# Altium schematic sheet MCU.SchDoc
size A3
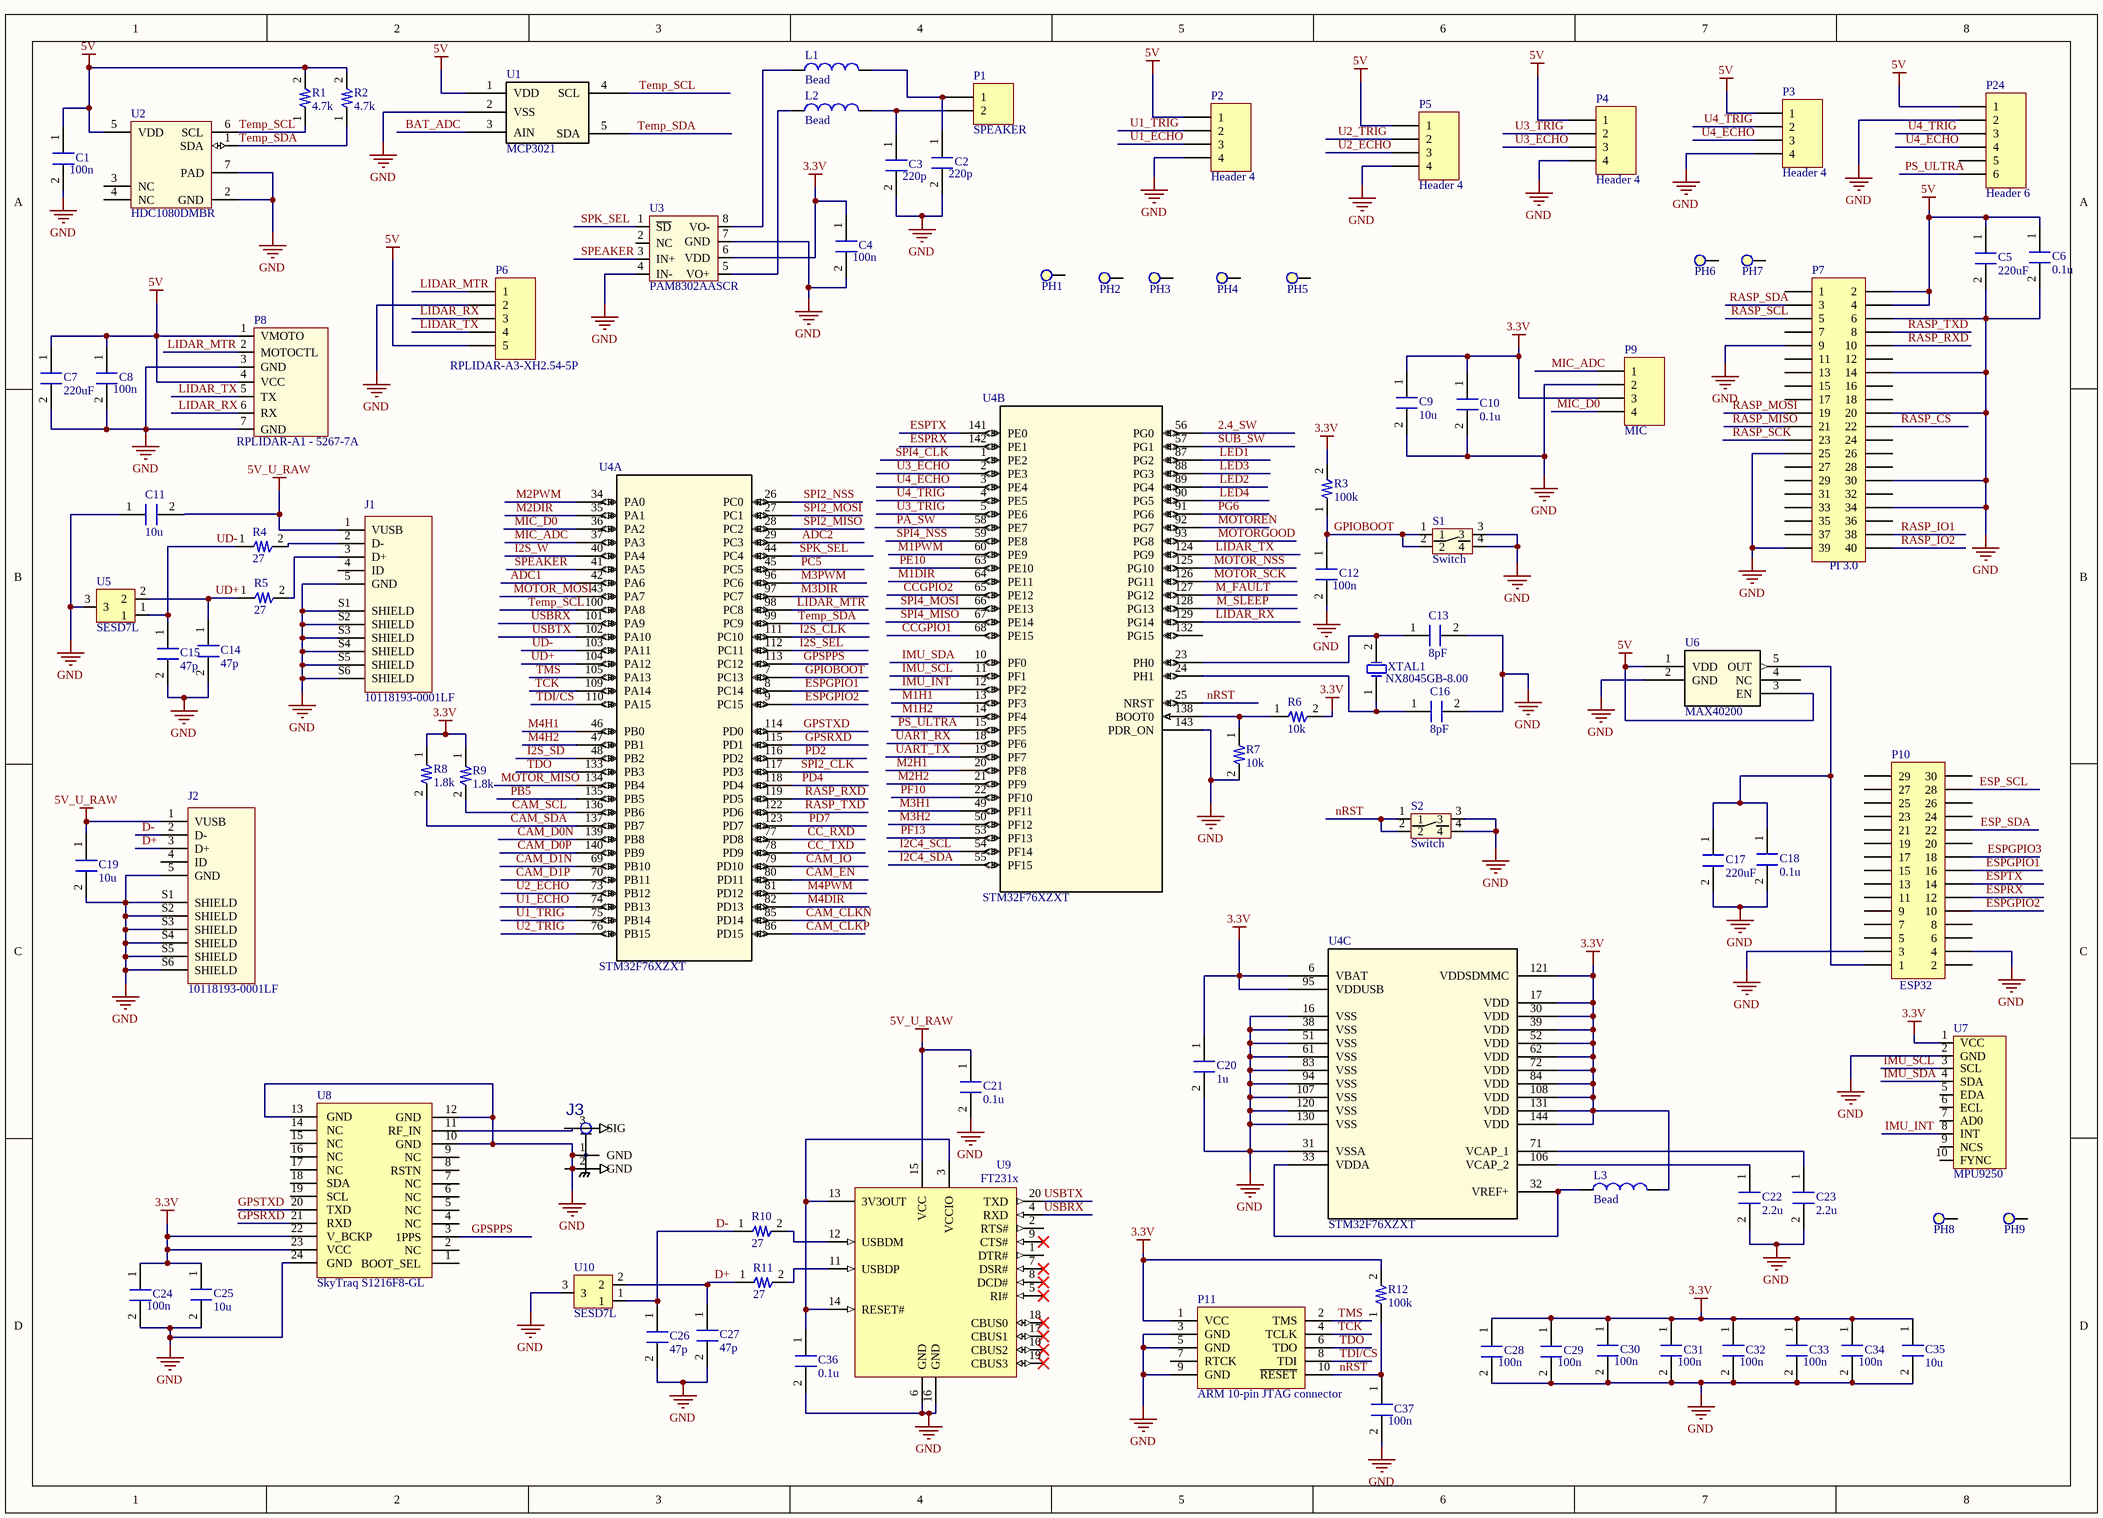
[diagram p0: MCU.SchDoc]

## Parts
C1  value 100n  [Capacitor 0402]  (hidden comment: Ceramic Capacitor)
C2  value 220p  [Capacitor 0402]  (hidden comment: Ceramic Capacitor)
C3  value 220p  [Capacitor 0402]  (hidden comment: Ceramic Capacitor)
C4  value 100n  [Capacitor 0402]  (hidden comment: Ceramic Capacitor)
C5  value 220uF  [CAPAE250P680X1220_VERT]  (hidden comment: Ceramic Capacitor)
C6  value 0.1u  [Capacitor 0402]  (hidden comment: Ceramic Capacitor)
C7  value 220uF  [CAPAE250P680X1220_VERT]  (hidden comment: Ceramic Capacitor)
C8  value 100n  [Capacitor 0402]  (hidden comment: Ceramic Capacitor)
C9  value 10u  [Capacitor 0603]  (hidden comment: Ceramic Capacitor)
C10  value 0.1u  [Capacitor 0402]  (hidden comment: Ceramic Capacitor)
C11  value 10u  [Capacitor 0603]  (hidden comment: Ceramic Capacitor)
C12  value 100n  [Capacitor 0402]  (hidden comment: Ceramic Capacitor)
C13  value 8pF  [Capacitor 0402]  (hidden comment: Ceramic Capacitor)
C14  value 47p  [Capacitor 0402]  (hidden comment: Ceramic Capacitor)
C15  value 47p  [Capacitor 0402]  (hidden comment: Ceramic Capacitor)
C16  value 8pF  [Capacitor 0402]  (hidden comment: Ceramic Capacitor)
C17  value 220uF  [CAPAE250P680X1220_VERT]  (hidden comment: Ceramic Capacitor)
C18  value 0.1u  [Capacitor 0402]  (hidden comment: Ceramic Capacitor)
C19  value 10u  [Capacitor 0603]  (hidden comment: Ceramic Capacitor)
C20  value 1u  [Capacitor 0402]  (hidden comment: Ceramic Capacitor)
C21  value 0.1u  [Capacitor 0402]  (hidden comment: Ceramic Capacitor)
C22  value 2.2u  [Capacitor 0402]  (hidden comment: Ceramic Capacitor)
C23  value 2.2u  [Capacitor 0402]  (hidden comment: Ceramic Capacitor)
C24  value 100n  [Capacitor 0402]  (hidden comment: Ceramic Capacitor)
C25  value 10u  [Capacitor 0603]  (hidden comment: Ceramic Capacitor)
C26  value 47p  [Capacitor 0402]  (hidden comment: Ceramic Capacitor)
C27  value 47p  [Capacitor 0402]  (hidden comment: Ceramic Capacitor)
C28  value 100n  [Capacitor 0402]  (hidden comment: Ceramic Capacitor)
C29  value 100n  [Capacitor 0402]  (hidden comment: Ceramic Capacitor)
C30  value 100n  [Capacitor 0402]  (hidden comment: Ceramic Capacitor)
C31  value 100n  [Capacitor 0402]  (hidden comment: Ceramic Capacitor)
C32  value 100n  [Capacitor 0402]  (hidden comment: Ceramic Capacitor)
C33  value 100n  [Capacitor 0402]  (hidden comment: Ceramic Capacitor)
C34  value 100n  [Capacitor 0402]  (hidden comment: Ceramic Capacitor)
C35  value 10u  [Capacitor 0603]  (hidden comment: Ceramic Capacitor)
C36  value 0.1u  [Capacitor 0402]  (hidden comment: Ceramic Capacitor)
C37  value 100n  [Capacitor 0402]  (hidden comment: Ceramic Capacitor)
J1  10118193-0001LF  [FCI_10118193-0001LF_10118193-0001LF(Primary)]
J2  10118193-0001LF  [FCI_10118193-0001LF_10118193-0001LF(Primary)]
J3  U.FL-R-SMT(01)  [HRS_U.FL-R-SMT(01)]  (value not drawn)
L1  Bead  [Resistor 0603]
L2  Bead  [Resistor 0603]
L3  Bead  [Resistor 0603]
P1  SPEAKER  [HDR1X2]
P2  Header 4  [HDR1X4]
P3  Header 4  [HDR1X4]
P4  Header 4  [HDR1X4]
P5  Header 4  [HDR1X4]
P6  RPLIDAR-A3-XH2.54-5P  [HDR1X5]
P7  PI 3.0  [HDR2X20]
P8  RPLIDAR-A1 - 5267-7A  [HDR1X7]
P9  MIC  [HDR1X4]
P10  ESP32  [ESP32]
P11  ARM 10-pin JTAG connector  [MHDR2X5]
P24  Header 6  [HDR1X6]
PH1  Plated Hole  [PH-M3-A]  (value not drawn)
PH2  Plated Hole  [PH-M3-A]  (value not drawn)
PH3  Plated Hole  [PH-M3-A]  (value not drawn)
PH4  Plated Hole  [PH-M3-A]  (value not drawn)
PH5  Plated Hole  [PH-M3-A]  (value not drawn)
PH6  Plated Hole  [PH-M2-A]  (value not drawn)
PH7  Plated Hole  [PH-M2-A]  (value not drawn)
PH8  Plated Hole  [PH-M3-A]  (value not drawn)
PH9  Plated Hole  [PH-M3-A]  (value not drawn)
R1  value 4.7k  [Resistor 0402]  (hidden comment: Resistor)
R2  value 4.7k  [Resistor 0402]  (hidden comment: Resistor)
R3  value 100k  [Resistor 0402]  (hidden comment: Resistor)
R4  value 27  [Resistor 0402]  (hidden comment: Resistor)
R5  value 27  [Resistor 0402]  (hidden comment: Resistor)
R6  value 10k  [Resistor 0402]  (hidden comment: Resistor)
R7  value 10k  [Resistor 0402]  (hidden comment: Resistor)
R8  value 1.8k  [Resistor 0402]  (hidden comment: Resistor)
R9  value 1.8k  [Resistor 0402]  (hidden comment: Resistor)
R10  value 27  [Resistor 0402]  (hidden comment: Resistor)
R11  value 27  [Resistor 0402]  (hidden comment: Resistor)
R12  value 100k  [Resistor 0402]  (hidden comment: Resistor)
S1  Switch  [Switch]
S2  Switch  [Switch]
U1  MCP3021  [SOT23-5N]
U2  HDC1080DMBR  [DMB0006A]
U3  PAM8302AASCR  [MSOP-MS8_N]
U4  STM32F76XZXT  [LQFP-144_20X20mm]  (parts A,B,C of 3)
U5  SESD7L  [SOT-723]
U6  MAX40200  [21-0057F]
U7  MPU9250  [HDR1X10]
U8  SkyTraq S1216F8-GL  [SkyTraq S1216F8-GL]
U9  FT231x  [SSOP-20_N]
U10  SESD7L  [SOT-723]
XTAL1  NX8045GB-8.00  [NX8045G 8MHz Crystal]

## Nets
3.3V: C4.1 C9.1 C10.1 C20.1 C24.1 C25.1 C28.1 C29.1 C30.1 C31.1 C32.1 C33.1 C34.1 C35.1 L3.2 P9.3 P11.1(VCC) R3.2 R6.2 R8.1 R9.1 R12.2 U3.6(VDD) U4.6(VBAT) U4.17(VDD) U4.30(VDD) U4.39(VDD) U4.52(VDD) U4.62(VDD) U4.72(VDD) U4.84(VDD) U4.95(VDDUSB) U4.108(VDD) U4.121(VDDSDMMC) U4.131(VDD) U4.144(VDD) U7.1(VCC) U8.22(V_BCKP) U8.23(VCC)
5V: C1.1 C5.1 C6.1 C7.1 C8.1 P2.1 P3.1 P4.1 P5.1 P6.5 P7.2 P7.4 P8.1(VMOTO) P8.4(VCC) P24.1 R1.2 R2.2 U1.1(VDD) U2.5(VDD) U6.1(VDD) U6.3(EN)
5V_U_RAW: C11.2 C19.1 C21.1 J1.1(VUSB) J2.1(VUSB) U9.15(VCC)
GND: C1.2 C2.2 C3.2 C4.2 C5.2 C6.2 C7.2 C8.2 C9.2 C10.2 C11.1 C12.2 C13.2 C14.2 C15.2 C16.2 C17.2 C18.2 C19.2 C20.2 C21.2 C22.2 C23.2 C24.2 C25.2 C26.2 C27.2 C28.2 C29.2 C30.2 C31.2 C32.2 C33.2 C34.2 C35.2 C36.2 C37.2 J1.5(GND) J1.S1(SHIELD) J1.S2(SHIELD) J1.S3(SHIELD) J1.S4(SHIELD) J1.S5(SHIELD) J1.S6(SHIELD) J2.5(GND) J2.S1(SHIELD) J2.S2(SHIELD) J2.S3(SHIELD) J2.S4(SHIELD) J2.S5(SHIELD) J2.S6(SHIELD) J3.1(GND) J3.2(GND) P2.4 P3.4 P4.4 P5.4 P6.2 P7.6 P7.9 P7.14 P7.20 P7.25 P7.30 P7.34 P7.39 P8.3(GND) P8.7(GND) P9.2 P10.3 P10.4 P11.3(GND) P11.5(GND) P11.9(GND) P24.2 R7.2 S1.3 S1.4 S2.3 S2.4 U1.2(VSS) U2.2(GND) U2.7(PAD) U3.4(IN-) U3.7(GND) U4.16(VSS) U4.31(VSSA) U4.38(VSS) U4.51(VSS) U4.61(VSS) U4.83(VSS) U4.94(VSS) U4.107(VSS) U4.120(VSS) U4.130(VSS) U4.143(PDR_ON) U5.3 U6.2(GND) U7.2(GND) U8.10(GND) U8.12(GND) U8.13(GND) U8.24(GND) U9.6(GND) U9.16(GND) U10.3
2.4_SW: U4.56(PG0)
ADC1: U4.42(PA6)
ADC2: U4.29(PC3)
BAT_ADC: U1.3(AIN)
CAM_CLKN: U4.85(PD14)
CAM_CLKP: U4.86(PD15)
CAM_D0N: U4.139(PB8)
CAM_D0P: U4.140(PB9)
CAM_D1N: U4.69(PB10)
CAM_D1P: U4.70(PB11)
CAM_EN: U4.80(PD11)
CAM_IO: U4.79(PD10)
CAM_SCL: R9.2 U4.136(PB6)
CAM_SDA: R8.2 U4.137(PB7)
CC_RXD: U4.77(PD8)
CC_TXD: U4.78(PD9)
CCGPIO1: U4.68(PE15)
CCGPIO2: U4.65(PE12)
D+: C27.1 J2.3(D+) R11.1 U10.2
D-: C26.1 J2.2(D-) R10.1 U10.1
ESP_SCL: P10.28
ESP_SDA: P10.22
ESPGPIO1: P10.16 U4.8(PC14)
ESPGPIO2: P10.10 U4.9(PC15)
ESPGPIO3: P10.18
ESPRX: P10.12 U4.142(PE1)
ESPTX: P10.14 U4.141(PE0)
GPIOBOOT: C12.1 R3.1 S1.1 S1.2 U4.7(PC13)
GPSPPS: U4.113(PC12) U8.3(1PPS)
GPSRXD: U4.115(PD1) U8.21(RXD)
GPSTXD: U4.114(PD0) U8.20(TXD)
I2C4_SCL: U4.54(PF14)
I2C4_SDA: U4.55(PF15)
I2S_CLK: U4.111(PC10)
I2S_SD: U4.48(PB2)
I2S_SEL: U4.112(PC11)
I2S_W: U4.40(PA4)
IMU_INT: U4.12(PF2) U7.8(INT)
IMU_SCL: U4.11(PF1) U7.3(SCL)
IMU_SDA: U4.10(PF0) U7.4(SDA)
LED1: U4.87(PG2)
LED2: U4.89(PG4)
LED3: U4.88(PG3)
LED4: U4.90(PG5)
LIDAR_MTR: P6.1 P8.2(MOTOCTL) U4.98(PC8)
LIDAR_RX: P6.3 P8.6(RX) U4.129(PG14)
LIDAR_TX: P6.4 P8.5(TX) U4.124(PG9)
M1DIR: U4.64(PE11)
M1H1: U4.13(PF3)
M1H2: U4.14(PF4)
M1PWM: U4.60(PE9)
M2DIR: U4.35(PA1)
M2H1: U4.20(PF8)
M2H2: U4.21(PF9)
M2PWM: U4.34(PA0)
M3DIR: U4.97(PC7)
M3H1: U4.49(PF11)
M3H2: U4.50(PF12)
M3PWM: U4.96(PC6)
M4DIR: U4.82(PD13)
M4H1: U4.46(PB0)
M4H2: U4.47(PB1)
M4PWM: U4.81(PD12)
M_FAULT: U4.127(PG12)
M_SLEEP: U4.128(PG13)
MIC_ADC: P9.1 U4.37(PA3)
MIC_D0: P9.4 U4.36(PA2)
MOTOR_MISO: U4.134(PB4)
MOTOR_MOSI: U4.43(PA7)
MOTOR_NSS: U4.125(PG10)
MOTOR_SCK: U4.126(PG11)
MOTOREN: U4.92(PG7)
MOTORGOOD: U4.93(PG8)
nRST: C37.1 P11.10(~{RESET}) R12.1 S2.1 S2.2 U4.25(NRST)
PA_SW: U4.58(PE7)
PB5: U4.135(PB5)
PC5: U4.45(PC5)
PD2: U4.116(PD2)
PD4: U4.118(PD4)
PD7: U4.123(PD7)
PE10: U4.63(PE10)
PF10: U4.22(PF10)
PF13: U4.53(PF13)
PG6: U4.91(PG6)
PS_ULTRA: P24.6 U4.15(PF5)
RASP_CS: P7.22
RASP_IO1: P7.38
RASP_IO2: P7.40
RASP_MISO: P7.21
RASP_MOSI: P7.19
RASP_RXD: P7.10 U4.119(PD5)
RASP_SCK: P7.23
RASP_SCL: P7.5
RASP_SDA: P7.3
RASP_TXD: P7.8 U4.122(PD6)
SPEAKER: U3.3(IN+) U4.41(PA5)
SPI2_CLK: U4.117(PD3)
SPI2_MISO: U4.28(PC2)
SPI2_MOSI: U4.27(PC1)
SPI2_NSS: U4.26(PC0)
SPI4_CLK: U4.1(PE2)
SPI4_MISO: U4.67(PE14)
SPI4_MOSI: U4.66(PE13)
SPI4_NSS: U4.59(PE8)
SPK_SEL: U3.1(~{SD}) U4.44(PC4)
SUB_SW: U4.57(PG1)
TCK: P11.4(TCLK) U4.109(PA14)
TDI/CS: P11.8(TDI) U4.110(PA15)
TDO: P11.6(TDO) U4.133(PB3)
Temp_SCL: R1.1 U1.4(SCL) U2.6(SCL) U4.100(PA8)
Temp_SDA: R2.1 U1.5(SDA) U2.1(SDA) U4.99(PC9)
TMS: P11.2(TMS) U4.105(PA13)
U1_ECHO: P2.3 U4.74(PB13)
U1_TRIG: P2.2 U4.75(PB14)
U2_ECHO: P5.3 U4.73(PB12)
U2_TRIG: P5.2 U4.76(PB15)
U3_ECHO: P4.3 U4.2(PE3)
U3_TRIG: P4.2 U4.5(PE6)
U4_ECHO: P3.3 P24.4 U4.3(PE4)
U4_TRIG: P3.2 P24.3 U4.4(PE5)
UART_RX: U4.18(PF6)
UART_TX: U4.19(PF7)
UD+: C14.1 R5.1 U4.104(PA12) U5.2
UD-: C15.1 R4.1 U4.103(PA11) U5.1
USBRX: U4.101(PA9) U9.4(RXD)
USBTX: U4.102(PA10) U9.20(TXD)
NetC2_1: C2.1 L1.2 P1.1
NetC3_1: C3.1 L2.2 P1.2
NetC13_1: C13.1 U4.23(PH0) XTAL1.2(OSC2)
NetC16_1: C16.1 U4.24(PH1) XTAL1.1(OSC1)
NetC17_1: C17.1 C18.1 P10.1 U6.5(OUT)
NetC22_1: C22.1 U4.106(VCAP_2)
NetC23_1: C23.1 U4.71(VCAP_1)
NetC36_1: C36.1 U9.3(VCCIO) U9.13(3V3OUT) U9.14(RESET#)
NetJ1_2: J1.2(D-) R4.2
NetJ1_3: J1.3(D+) R5.2
NetJ3_3: J3.3(SIG) U8.11(RF_IN)
NetL1_1: L1.1 U3.8(VO-)
NetL2_1: L2.1 U3.5(VO+)
NetL3_1: L3.1 U4.32(VREF+) U4.33(VDDA)
NetR6_1: R6.1 R7.1 U4.138(BOOT0)
NetR10_2: R10.2 U9.12(USBDM)
NetR11_2: R11.2 U9.11(USBDP)

Not connected (* = marked no-connect by the designer): J1 4(ID); J2 4(ID); P7 1 7 11 12 13 15 16 17 18 24 26 27 28 29 31 32 33 35 36 37; P10 2 5 6 7 8 9 11 13 15 17 19 20 21 23 24 25 26 27 29 30; P11 7(RTCK); P24 5; PH1 1(Hole); PH2 1(Hole); PH3 1(Hole); PH4 1(Hole); PH5 1(Hole); PH6 1(Hole); PH7 1(Hole); PH8 1(Hole); PH9 1(Hole); U2 3(NC) 4(NC); U3 2(NC); U4 132(PG15); U6 4(NC); U7 5(EDA) 6(ECL) 7(AD0) 9(NCS) 10(FYNC); U8 1(BOOT_SEL) 2(NC) 4(NC) 5(NC) 6(NC) 7(NC) 8(RSTN) 9(NC) 14(NC) 15(NC) 16(NC) 17(NC) 18(SDA) 19(SCL); U9 1(DTR#) 2(RTS#) 5(RI#)* 7(DSR#)* 8(DCD#)* 9(CTS#)* 10(CBUS2)* 17(CBUS1)* 18(CBUS0)* 19(CBUS3)*

## Library data of the parts
J1 J2 = USB mini 10118193-0001LF: USB mini; Digikey: *
J3 = U.FL-R-SMT(01): U.FL Series 6 Ghz 50 Ohm Ultra-small SMT Coaxial Cable Receptacle; MF: Hirose; Price: 0.80 USD; Availability: Good; Package: None; MP: U.FL-R-SMT(01); Value: *
L1-L3 = Inductor: Digikey: 490-13259-1-ND
P1 = Header 2: Header, 2-Pin; LatestRevisionDate: 17-Jul-2002; LatestRevisionNote: Re-released for DXP Platform.; Publisher: Altium Limited
P2-P5 P9 = Header 4: Header, 4-Pin; LatestRevisionDate: 17-Jul-2002; LatestRevisionNote: Re-released for DXP Platform.; Publisher: Altium Limited
P6 = Header 5: Header, 5-Pin; LatestRevisionDate: 17-Jul-2002; LatestRevisionNote: Re-released for DXP Platform.; Publisher: Altium Limited
P7 = Header 20X2: Header, 20-Pin, Dual row; LatestRevisionDate: 17-Jul-2002; LatestRevisionNote: Re-released for DXP Platform.; Publisher: Altium Limited
P8 = RPLIDAR A1
P10 = Header 15X2: Header, 15-Pin, Dual row; LatestRevisionDate: 17-Jul-2002; LatestRevisionNote: Re-released for DXP Platform.; Publisher: Altium Limited
P11 = ARM JTAG: ARM JTAG/SWD connector; Farnell Code: 1865279
P24 = Header 6: Header, 6-Pin; LatestRevisionDate: 17-Jul-2002; LatestRevisionNote: Re-released for DXP Platform.; Publisher: Altium Limited
PH1-PH9 = PH: Plated hole for threaded rods; LatestRevisionDate: 31-07-2014; Published: 31-07-2014; Publisher: N.F.Baltazar Santos - DelFFi
R1-R12 = Resistor: General Purpose Resistor
  R1-R3 R6-R9 R12: Digikey: *
  R4 R5 R10 R11: Digikey: P27DDCT-ND
U1 = MCP3021: ADC
U2 = HDC1080DMBR: No Description Available; Application_BuildNumber: *
U3 = PAM8302AASCR: Speaker amplifier
U4 = STM32F76XZXT: Imported; Vendor: STMicroelectronics; C: Copyright (C) 2016 Accelerated Designs. All rights reserved; Manufacturer_Part_Number: stm32f76xzxt; Copyright: Copyright (C) 2016 Accelerated Designs. All rights reserved; RefDes: RefDes; Type: DEV; Value: Value
U5 U10 = SESD7L: TVS Diode - USB
U6 = MAX40200: No Description Available
U8 = SkyTraq S1216F8-GL: Skytraq S1216F8-GL GPS chip
XTAL1 = NDK NX8045G 8MHz: Surface Mount Quartz Crystal; Value: 8MHz; Digikey: NX8045GB-8.00
C1-C37 = Ceramic Capacitor
  C1-C13 C16-C25 C28-C37: Digikey: *
  C14 C15 C26 C27: Digikey: 445-5592-1-ND
U9 = FT231x: Digikey: 768-1129-1-ND